# Altium project RFModAdapter_v1.PrjPCB
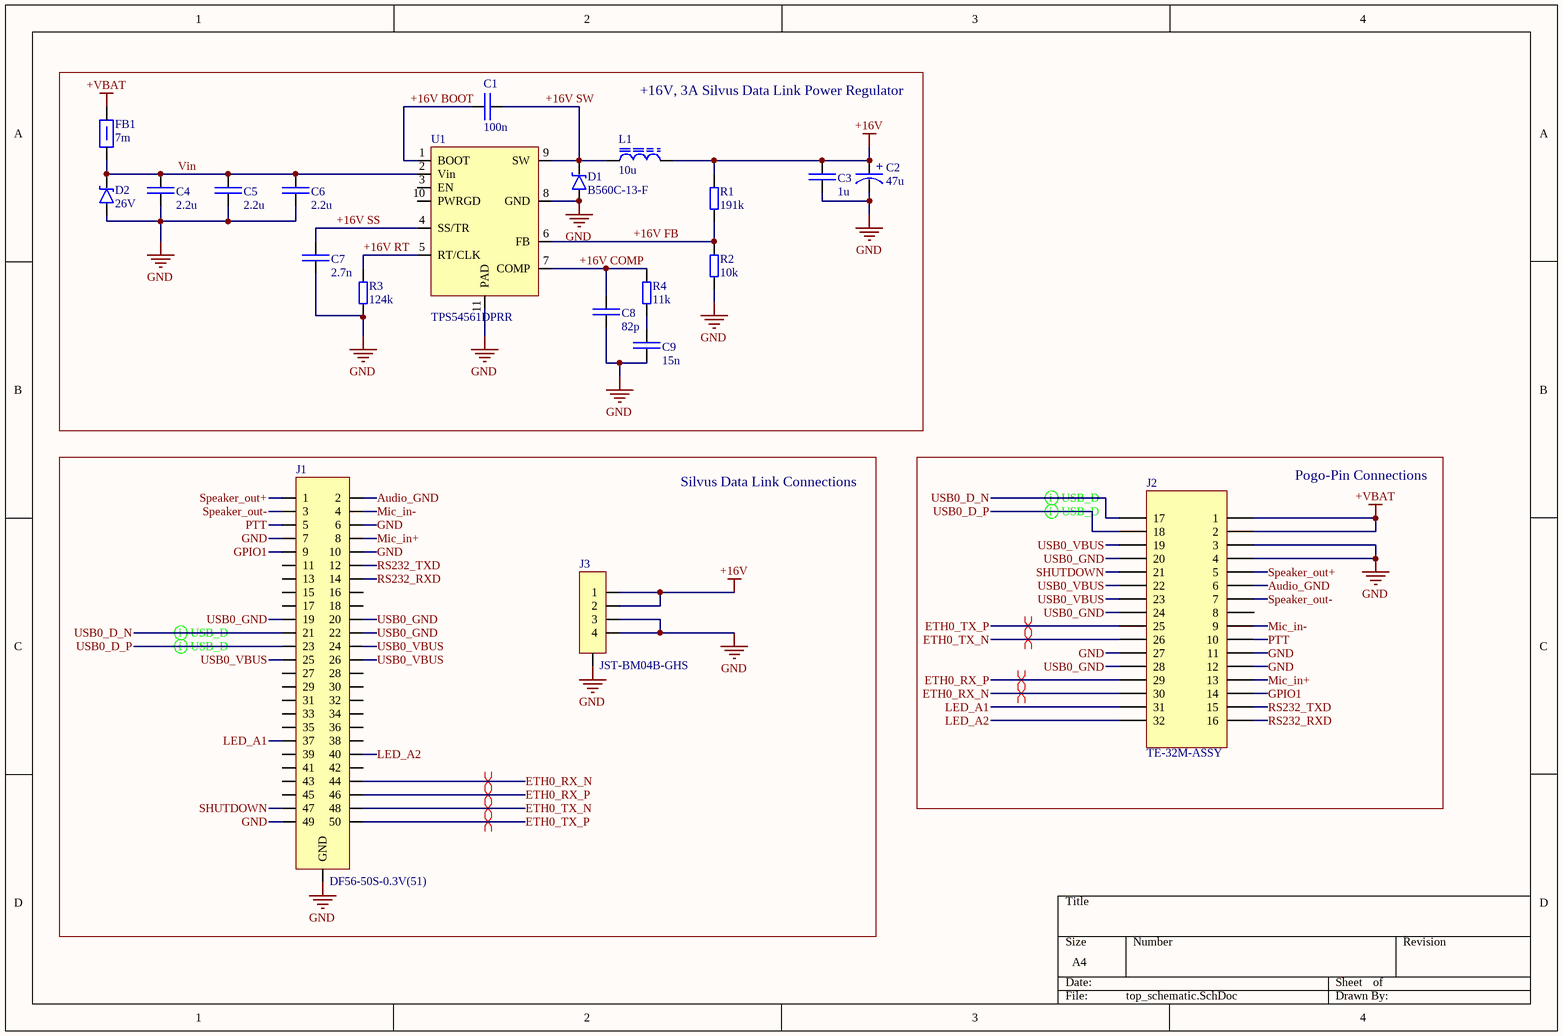
[diagram p0: top_schematic.SchDoc]
1 sheet, 21 parts. Net scope: global (net labels, ports and power ports of the same name join across sheets).
Board files: pcb.PcbDoc, RFModAdapter_v1.PcbDoc

## Sheet top_schematic.SchDoc
size A4

### Parts
C1  100n  [CAP_0402]
C2  47u  [25SVPF47M C6]
C3  1u  [CAP_0805]
C4  2.2u  [CAP_0805]
C5  2.2u  [CAP_0805]
C6  2.2u  [CAP_0805]
C7  2.7n  [CAP_0402]
C8  82p  [CAP_0402]
C9  15n  [CAP_0402]
D1  B560C-13-F  [B560C-13-F]
D2  26V  [DO-214AC_diode]
FB1  7m  [ferrite_0603]
J1  DF56-50S-0.3V(51)  [Header_Hirose_DF56]
J2  TE-32M-ASSY  [TE-32M-ASSY]
J3  JST-BM04B-GHS  [JST-BM04B_HEADER]
L1  10u  [ETQ-P3M100HFN]
R1  191k  [RES_0402]
R2  10k  [RES_0402]
R3  124k  [RES_0402]
R4  11k  [RES_0402]
U1  TPS54561DPRR  [WSON-10]

### Blocks framed on the sheet
+16V, 3A Silvus Data Link Power Regulator: C1-C9 D1 D2 FB1 L1 R1-R4 U1
Silvus Data Link Connections: J1 J3
Pogo-Pin Connections: J2

### Nets
+16V: C2.1 C3.1 J3.1 J3.2 L1.2 R1.2
+VBAT: FB1.2 J2.1 J2.2
GND: C2.2 C3.2 C4.2 C5.2 C6.2 C7.2 C8.2 C9.2 D1.2 D2.2 J1.6 J1.7 J1.10 J1.49 J1.GND J2.3 J2.4 J2.11 J2.12 J2.27 J3.3 J3.4 J3.GND R2.1 R3.1 U1.8(GND) U1.11(PAD)
+16V BOOT: C1.2 U1.1(BOOT)
+16V COMP: C8.1 R4.2 U1.7(COMP)
+16V FB: R1.1 R2.2 U1.6(FB)
+16V RT: R3.2 U1.5(RT/CLK)
+16V SS: C7.1 U1.4(SS/TR)
+16V SW: C1.1 D1.1 L1.1 U1.9(SW)
Audio_GND: J1.2 J2.6
ETH0_RX_N: J1.44 J2.30
ETH0_RX_P: J1.46 J2.29
ETH0_TX_N: J1.48 J2.26
ETH0_TX_P: J1.50 J2.25
GPIO1: J1.9 J2.14
LED_A1: J1.37 J2.31
LED_A2: J1.40 J2.32
Mic_in+: J1.8 J2.13
Mic_in-: J1.4 J2.9
PTT: J1.5 J2.10
RS232_RXD: J1.14 J2.16
RS232_TXD: J1.12 J2.15
SHUTDOWN: J1.47 J2.21
Speaker_out+: J1.1 J2.5
Speaker_out-: J1.3 J2.7
USB0_D_N: J1.21 J2.17
USB0_D_P: J1.23 J2.18
USB0_GND: J1.19 J1.20 J1.22 J2.20 J2.24 J2.28
USB0_VBUS: J1.24 J1.25 J1.26 J2.19 J2.22 J2.23
Vin: C4.1 C5.1 C6.1 D2.1 FB1.1 U1.2(Vin)
NetC9_1: C9.1 R4.1

Not connected (* = marked no-connect by the designer): J1 11 13 15 16 17 18 27 28 29 30 31 32 33 34 35 36 38 39 41 42 43 45; J2 8; U1 3(EN) 10(PWRGD)

### Layout directives
differential pair: ETH0_RX_N, ETH0_RX_P, ETH0_TX_N, ETH0_TX_P, USB0_D_N, USB0_D_P

### Notes on the sheet
- (in symbol 47uF 25SVPF47M) +

### Library data of the parts
C1 = 0402, 100nF, 50V, X7R, ESR 0m, MLCC: Manufacturer: Any; Part description: 0402, 100nF, 50V, X7R, ESR 0m, MLCC
C2 = 47uF 25SVPF47M: 47µF 25V Aluminum Polymer Capacitor Radial, Can - SMD 30mOhm 5000 Hrs @ 105°C; Manufacturer: Panasonic Electronic Components; Part number: 25SVPF47M
C3 = 0805, 1uF, 50V, X7R, ESR 0m, MLCC: Part description: Any; Manufacturer: 0805, 1uF, 50V, X7R, ESR 0m, MLCC
C4-C6 = 0805, 2.2uF, 50V, X5R, ESR 0m, MLCC: Manufacturer: Any; Part Description: 0805, 2.2uF, 50V, X5R, ESR 0m, MLCC
C7 = 0402, 2.7nF, 50V, X7R, ESR 0m, MLCC: Manufacturer: Any; Part description: 0402, 2.7nF, 50V, X7R, ESR 0m, MLCC
C8 = 0402, 82pF, 50V, C0G/NP0, ESR 0m, MLCC: Manufacturer: Any; Part description: 0402, 82pF, 50V, C0G/NP0, ESR 0m, MLCC
C9 = 0402, 15nF, 50V, X7R, ESR 0m, MLCC: Manufacturer: Any; Part description: 0402, 15nF, 50V, X7R, ESR 0m, MLCC
D1 = B560C-13-F: Diode Schottky 60V 5A Surface Mount SMC; Manufacturer: Diodes Inc.; Part Number: B560C-13-F
D2 = SMAJ26A-Q: 26V Standoff, 42.1V Clamp 9.5A Ipp Tvs Diode Surface Mount DO-214AC (SMA); Manufacturer: Bourns; Supplier 1: Mouser; Supplier Part Number 1: 652-SMAJ26A-Q; Manufacturer Part Number: SMAJ26A-Q; Stock 1: 3773; Pricing 1: 1=0.39, 10=0.282, 50=0.282, 100=0.191, 500=0.158, 1000=0.11, 5000=0.099, 10000=0.094, 25000=0.087, 50000=0.08 (USD); Part number: SMAJ26A-Q; Link: https://eu.mouser.com/ProductDetail/Bourns/SMAJ26A-Q?qs=sGAEpiMZZMvxHShE6Whpu9pBowPIygZN5%252BokUABxykU%3D
FB1 = FBMJ1608HM230NT: 23 Ohms @ 100MHz 1 Power Line Ferrite Bead 0603 (1608 Metric) 4A 7mOhm; Manufacturer: Taiyo Yuden; Tolerance: 30%; Impedance: 23R; Number of Lines: 1; DC Resistance (DCR): 7mR; Shielding: Unshielded; Supplier 1: Mouser; Supplier Part Number 1: 963-FBMJ1608HM230NT; Manufacturer Part Number: FBMJ1608HM230NT; Stock 1: 10439; Pricing 1: 1=0.1, 10=0.05, 50=0.05, 100=0.034, 500=0.029, 1000=0.024, 4000=0.022, 8000=0.019, 10000=0.019, 24000=0.018 (USD); Mount: Surface Mount; Case/Package: 0603; Number of Pins: 2; Case Code (Metric): 1608; Case Code (Imperial): 0603; Core Material: Ferrite; Material: Ferrite; Min Operating Temperature: -40°C; Max Operating Temperature: 125°C; Package Quantity: 1; Packaging: Tape and Reel; Max Current Rating: 4A; Max DC Current: 4A; Termination: SMD/SMT; Test Frequency: 100MHz; Frequency: 100MHz; Composition: Ferrite Bead; Length: 1.6mm; Height: 0.8mm; Width: 0.031inch; Depth: 0.95mm; Halogen Free: Halogen Free; REACH SVHC: Unknown; Lead Free: Lead Free; ComponentLink1URL: http://documents.rs-components.com/techlib://itc_doclist_GB.htm?stockno=7555649&src-supplier=RSComponents; ComponentLink1Description: http://documents.rs-components.com/techlib://itc_doclist_GB.htm?stockno=7555649&src-supplier=RSComponents; ComponentLink2URL: http://ds.yuden.co.jp/TYCOMPAS/ut/detail.do?productNo=FBMJ1608HM230NT&fileName=FBMJ1608HM230NT_SS&mode=specSheetDownload&src-supplier=Digi-Key; ComponentLink2Description: http://ds.yuden.co.jp/TYCOMPAS/ut/detail.do?productNo=FBMJ1608HM230NT&fileName=FBMJ1608HM230NT_SS&mode=specSheetDownload&src-supplier=Digi-Key; ComponentLink3URL: http://www.yuden.co.jp/productdata/catalog/en/chipbeads01_e.pdf?src-supplier=Digi-Key; ComponentLink3Description: http://www.yuden.co.jp/productdata/catalog/en/chipbeads01_e.pdf?src-supplier=Digi-Key; Part number: FBMJ1608HM230NT; Link: https://eu.mouser.com/ProductDetail/Taiyo-Yuden/FBMJ1608HM230NT?qs=I6KAKw0tg2z0Uk65Nuq%2FcA==
J1 = DF56-50S-0.3V(51): CONN RCPT 50POS 0.012 GOLD SMD; Manufacturer: Hirose; Number of Positions: 50; Connector Type: Receptacle,Non-Gendered; Pitch: 0.012inch; Supplier 1: Mouser; Supplier Part Number 1: 798-DF56-50S-0.3V51; Manufacturer Part Number: DF56-50S-0.3V(51); Stock 1: 0; Pricing 1: 1=1.65, 10=1.47, 25=1.35, 50=1.35, 100=1.29, 250=1.16, 500=1.07, 1000=0.915, 10000=0.915 (USD); Mount: Surface Mount; Color: Black; Contact Plating: Gold; Package Quantity: 5000; Packaging: Tape and Reel; Number of Rows: 1; Fastening Type: Detent; Termination: Solder; ComponentLink1URL: https://www.hirose.com/product/en/download_file/key_name/DF56-50S-0.3V%2851%29/category/Specification%20Sheet/doc_file_id/45372/?file_category_id=9&item_id=06625606751&is_series=&src-supplier=Digi-Key; ComponentLink1Description: https://www.hirose.com/product/en/download_file/key_name/DF56-50S-0.3V%2851%29/category/Specification%20Sheet/doc_file_id/45372/?file_category_id=9&item_id=06625606751&is_series=&src-supplier=Digi-Key; ComponentLink2URL: http://www.mouser.com/ds/2/185/DF56_catalog-939255.pdf?src-supplier=Mouser; ComponentLink2Description: http://www.mouser.com/ds/2/185/DF56_catalog-939255.pdf?src-supplier=Mouser; Category: Connectors
J2 = Pogo-connector-32pin-API: API/SupplyNet pogo-pin connector, 32pins, 4 rows; Manufacturer: SupplyNet; Part number: TE-32M-ASSY
J3 = BM04B-GHS-TBT(LF)(SN)(N): CONN HEADER SMD 4POS 1.25MM, JST-GH series; Manufacturer: JST; Number of Positions: 4; Connector Type: Outer Shroud Contact; Pitch: 0.049inch; Supplier 1: Digi-Key; Supplier Part Number 1: 455-1580-6-ND; Manufacturer Part Number: BM04B-GHS-TBT(LF)(SN)(N); Stock 1: 145959; Pricing 1: 1=0.44, 10=0.413, 100=0.3163, 500=0.275, 1000=0.2269 (USD); Mount: Surface Mount; Number of Pins: 4; Color: Natural; Contact Plating: Tin; Packaging: Tape and Reel; Number of Rows: 1; Termination: Solder; Fastening Type: Ramp; Lead Free: Lead Free; Category: Connectors
L1 = 10u ETQ-P3M100HFN: 10µH Shielded  Inductor 3.7A 74.8mOhm Max 2-SMD, J-Lead; Manufacturer: Panasonic Electronic Components; Part number: ETQ-P3M100HFN
R1 = Resistor 0402 191k: 0402, 191k, 1%, 0.1W, Res; Manufacturer: Any; Part description: 0402, 191k, 1%, 0.1W, Res
R2 = Resistor 0402 10k: 0402, 10k, 1%, 0.1W, Res; Manufacturer: Any; Part description: 0402, 10k, 1%, 0.1W, Res
R3 = Resistor 0402 124k: 0402, 124k, 1%, 0.1W, Res; Manufacturer: Any; Part description: 0402, 124k, 1%, 0.1W, Res
R4 = Resistor 0402 11k: 0402, 11k, 1%, 0.1W, Res; Manufacturer: Any; Part description: 0402, 11k, 1%, 0.1W, Res
U1 = TPS54561DPRR: Buck, Split Rail Switching Regulator IC Positive Adjustable 0.8V 1 Output 5A 10-WDFN Exposed Pad; Manufacturer: Texas Instruments; Part number: TPS54331DDA

## Assembly variants
RFModAdapter_v1_J2_not_fitted: not fitted J2
RFModAdapter_v1: all parts fitted